# EAGLE board harp camera controller v.1.1 (EAGLE 9.5.1)
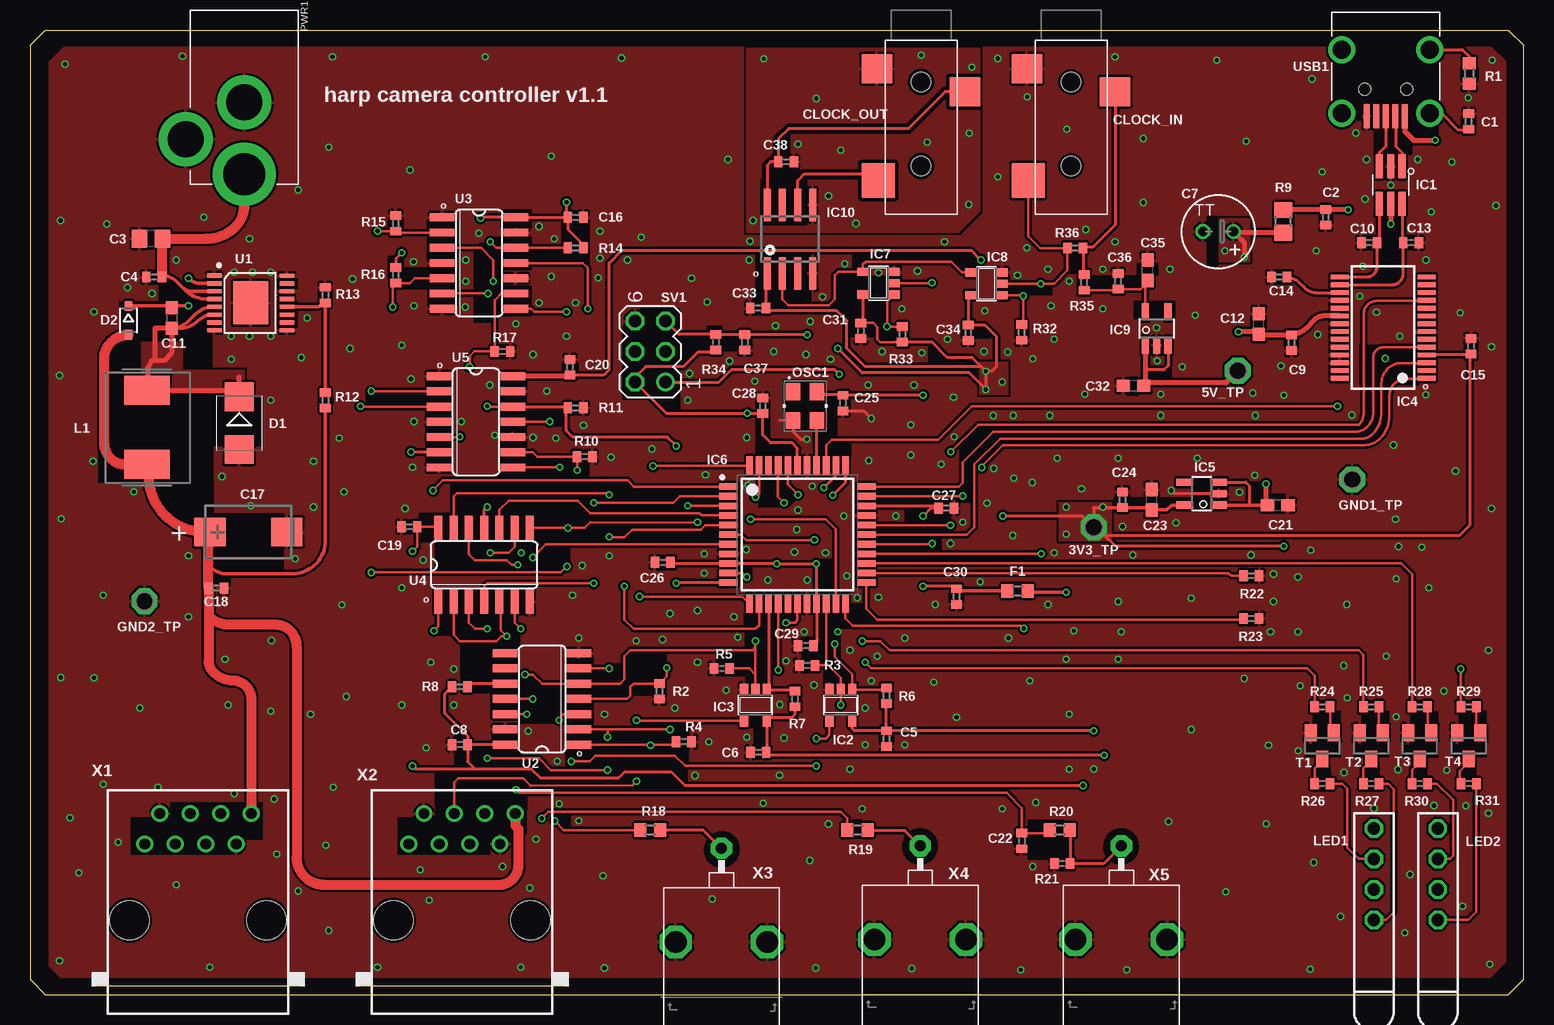
[diagram p2: board, top side]
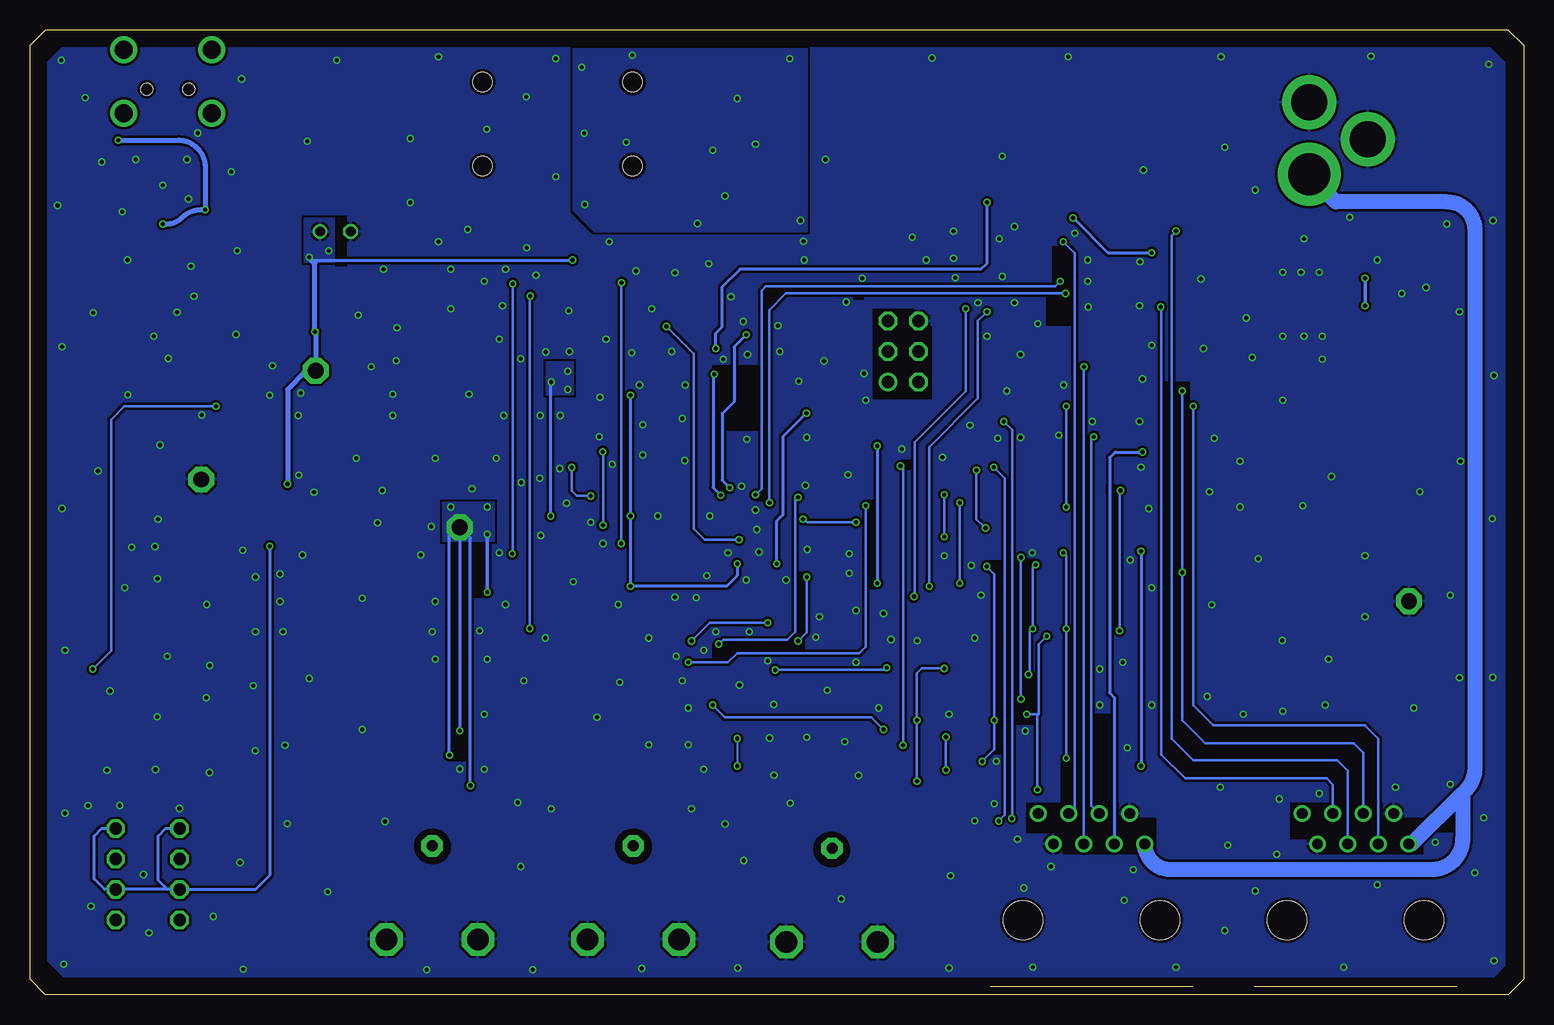
[diagram p3: board, bottom side, seen from below]

Size 124.46 x 80.38 mm. Coordinates in mm from the lower left corner, seen from the top.
Outline: 0,79.11 0,1.27 1.27,0 123.19,0 124.46,1.27 124.46,79.11 123.19,80.38 1.27,80.38 0,79.11
Copper layers (1*16): Top 0.018mm / dielectric 0.36mm / Bottom 0.018mm
Design rules "harp camera controller v.1.0 design rules": minimum track width 0.15mm, minimum drill 0.35mm, track to track 6mil, track to pad 6mil, pad to pad 6mil, via to via 6mil, smd to smd 6mil, copper to edge 0.25mm, drill to drill 0.35mm, minimum pad ring 0.175mm, minimum via ring 0.125mm, stop-mask expansion 0mil, vias tented up to drill 0.45mm, thermal gap 0.2mm
Net classes: 0 default: clearance 0.205 mm; 1 IOss: clearance 0.35 mm

## Footprints (pad centres in the part's own frame; a part is rotated, then mirrored left to right if it is on the bottom)
P1-13 = drill 1.321 pad 2.159 octagon: TP 0,0
C0402 = smd 0.7 x 0.9: 1 -0.65,0; 2 0.65,0
C0805 = smd 1.3 x 1.5: 1 -0.95,0; 2 0.95,0
TT2D6 = drill 0.813: + -1.27,0 | drill 0.813 octagon: - 1.27,0
C0603 = smd 1.1 x 1: 1 -0.85,0; 2 0.85,0
CT7343 = smd 2.6 x 2.4: + -3.2,0; - 3.2,0
35RASMT2BHNTRX = smd 2.4 x 2.55: 1 0.8,3.675; 5 -1.1,-3.675 | smd 2.9 x 2.75: 4 8.2,-3.575 | hole 1.6: 0,0; 7,0
SMB = smd 2.4 x 2.4: A 2.2,0; C -2.2,0
SOD323-R = smd 0.8 x 0.6: A 1.2,0; C -1.2,0
R0603 = smd 1 x 1.1: 1 -0.85,0; 2 0.85,0
SOT23-6L = smd 0.6 x 2: P$1 -0.95,-1.55; P$2 0,-1.55; P$3 0.95,-1.55; P$4 0.95,1.55; P$5 0,1.55; P$6 -0.95,1.55
SOT23-5 = smd 0.69 x 0.99: 1 -0.95,-1.29; 2 0,-1.29; 3 0.95,-1.29; 4 0.95,1.3; 5 -0.95,1.3
SSOP28 = smd 0.4 x 1.5: 1 -4.225,-3.625; 2 -3.575,-3.625; 3 -2.925,-3.625; 4 -2.275,-3.625; 5 -1.625,-3.625; 6 -0.975,-3.625; 7 -0.325,-3.625; 8 0.325,-3.625; 9 0.975,-3.625; 10 1.625,-3.625; 11 2.275,-3.625; 12 2.925,-3.625; 13 3.575,-3.625; 14 4.225,-3.625; 15 4.225,3.625; 16 3.575,3.625; 17 2.925,3.625; 18 2.275,3.625; 19 1.625,3.625; 20 0.975,3.625; 21 0.325,3.625; 22 -0.325,3.625; 23 -0.975,3.625; 24 -1.625,3.625; 25 -2.275,3.625; 26 -2.925,3.625; 27 -3.575,3.625; 28 -4.225,3.625
TSOT23-5 = smd 0.6 x 1.408: 1 -0.95,-1.404; 2 0,-1.404; 3 0.95,-1.404; 4 0.95,1.404; 5 -0.95,1.404
QFP80P1200X1200X120-44N = smd 1.55 x 0.55: 1 -5.75,4; 2 -5.75,3.2; 3 -5.75,2.4; 4 -5.75,1.6; 5 -5.75,0.8; 6 -5.75,0; 7 -5.75,-0.8; 8 -5.75,-1.6; 9 -5.75,-2.4; 10 -5.75,-3.2; 11 -5.75,-4; 23 5.75,-4; 24 5.75,-3.2; 25 5.75,-2.4; 26 5.75,-1.6; 27 5.75,-0.8; 28 5.75,0; 29 5.75,0.8; 30 5.75,1.6; 31 5.75,2.4; 32 5.75,3.2; 33 5.75,4 | smd 0.55 x 1.55: 12 -4,-5.75; 13 -3.2,-5.75; 14 -2.4,-5.75; 15 -1.6,-5.75; 16 -0.8,-5.75; 17 0,-5.75; 18 0.8,-5.75; 19 1.6,-5.75; 20 2.4,-5.75; 21 3.2,-5.75; 22 4,-5.75; 34 4,5.75; 35 3.2,5.75; 36 2.4,5.75; 37 1.6,5.75; 38 0.8,5.75; 39 0,5.75; 40 -0.8,5.75; 41 -1.6,5.75; 42 -2.4,5.75; 43 -3.2,5.75; 44 -4,5.75
SO-08 = smd 0.6 x 2.708: 1 -1.905,-2.854; 2 -0.635,-2.854; 3 0.635,-2.854; 4 1.905,-2.854; 5 1.905,2.854; 6 0.635,2.854; 7 -0.635,2.854; 8 -1.905,2.854
L_IHLP_PADS = smd 2.413 x 3.81: 1 -3.1,0; 2 3.1,0
569-011X-X00_LED_ARRAY = drill 1.016 octagon: A1 -6.35,0; A2 -1.27,0; C1 -8.89,0; C2 -3.81,0
OSCILLATOR_3.2X2.5 = smd 1.4 x 1.2: P$1 -1.2,-1; P$2 1.2,-1; P$3 1.2,1; P$4 -1.2,1
DC_POWER_INPUT_2.1MM = drill 3.5: P1 8.5,0 | drill 3: P2 2.5,0; P3 5.55,-4.9
R0402 = smd 0.7 x 0.9: 1 -0.65,0; 2 0.65,0
R0805 = smd 1.3 x 1.5: 1 -0.95,0; 2 0.95,0
MA03-2 = drill 1.016: 1 -2.54,-1.27 | drill 1.016 octagon: 2 -2.54,1.27; 3 0,-1.27; 4 0,1.27; 5 2.54,-1.27; 6 2.54,1.27
SOT23 = smd 1 x 1.4: 1 -0.95,-1.1; 2 0.95,-1.1; 3 0,1.1
TSSOP16EXP = smd 0.35 x 1.2: 1 -2.159,-2.897; 2 -1.504,-2.897; 3 -0.854,-2.897; 4 -0.204,-2.897; 5 0.446,-2.897; 6 1.096,-2.897; 7 1.746,-2.897; 8 2.396,-2.897; 9 2.396,3.148; 10 1.746,3.148; 11 1.096,3.148; 12 0.446,3.148; 13 -0.204,3.148; 14 -0.854,3.148; 15 -1.504,3.148; 16 -2.154,3.148 | smd 3.58 x 2.9: 17 0.121,0.126
SO14 = smd 0.66 x 2.032: 1 -3.81,-3.073; 2 -2.54,-3.073; 3 -1.27,-3.073; 4 0,-3.073; 5 1.27,-3.073; 6 2.54,-3.073; 7 3.81,-3.073; 8 3.81,3.073; 9 2.54,3.073; 10 1.27,3.073; 11 0,3.073; 12 -1.27,3.073; 13 -2.54,3.073; 14 -3.81,3.073
240-0002-1 = smd 0.5 x 2: P$1 -1.6,8.65; P$2 -0.8,8.65; P$3 0,8.65; P$4 0.8,8.65; P$5 1.6,8.65 | drill 1.5: SHIELD_1 -3.65,3.1; SHIELD_2 3.65,3.1; SHIELD_3 3.65,8.4; SHIELD_4 -3.65,8.4 | hole 1: -1.75,6.4; 1.75,6.4
RJ45-NO-SHIELD = drill 0.9 pad 1.4: 1 -4.445,6.35; 2 -3.175,8.89; 3 -1.905,6.35; 4 -0.635,8.89; 5 0.635,6.35; 6 1.905,8.89; 7 3.175,6.35; 8 4.445,8.89 | hole 3.251: -5.715,0; 5.715,0
0731000105 = drill 0.914 pad 1.778 octagon: 1 0,12.395 | drill 1.803 octagon: 2 -3.81,4.597; 3 3.81,4.597

## Placement (x,y rotation side)
3V3_TP  TPPAD1-13  [P1-13]  88.64,38.94 0 top
5V_TP  TPPAD1-13  [P1-13]  100.66,51.99 0 top
C1  4.7nF  [C0402]  119.89,72.76 90 top
C2  100nF  [C0402]  107.98,64.77 270 top
C3  4.7uF  [C0805]  10.08,62.99 180 top
C4  100nF  [C0402]  10.34,59.79 180 top
C5  100nF  [C0402]  71.37,21.34 270 top
C6  100nF  [C0402]  60.71,20.19 180 top
C7  100u 25V  [TT2D6]  99.01,63.59 180 top
C8  100nF  [C0402]  35.81,20.83 180 top
C9  100nF  [C0402]  105.13,54.33 270 top
C10  47pF  [C0402]  111.61,62.66 180 top
C11  180nF  [C0603]  11.81,56.39 270 top
C12  4.7uF  [C0603]  102.41,55.88 90 top
C13  47pF  [C0402]  115.09,62.66 0 top
C14  100nF  [C0402]  104.11,59.79 180 top
C15  100nF  [C0402]  120.09,54.03 90 top
C16  100nF  [C0402]  45.47,64.77 0 top
C17  100uF 16V  [CT7343]  18.2,38.55 0 top
C18  100nF  [C0402]  15.51,33.87 0 top
C19  100nF  [C0402]  31.62,38.99 180 top
C20  100nF  [C0402]  45,52.28 90 top
C21  4.7uF  [C0603]  103.98,40.79 0 top
C22  330pF  [C0402]  82.65,12.8 270 top
C23  4.7uF  [C0603]  93.47,41.24 90 top
C24  100nF  [C0402]  91.04,41.24 90 top
C25  100nF  [C0402]  67.74,49.29 270 top
C26  100nF  [C0402]  52.73,36.02 180 top
C27  100nF  [C0402]  76.35,40.54 0 top
C28  100nF  [C0402]  61.06,49.07 90 top
C29  100nF  [C0402]  64.64,29.08 180 top
C30  330pF  [C0402]  77.22,33.17 270 top
C31  100nF  [C0402]  69.24,55.32 270 top
C32  4.7uF  [C0603]  91.97,50.73 180 top
C33  100nF  [C0402]  60.67,57.21 180 top
C34  100nF  [C0402]  78.19,55.17 270 top
C35  4.7uF  [C0603]  93.13,60.36 90 top
C36  100nF  [C0402]  90.68,59.44 90 top
C37  330pF  [C0402]  59.57,54.35 270 top
C38  100nF  [C0402]  63,69.41 0 top
CLOCK_IN  CLCK_JACK  [35RASMT2BHNTRX]  86.75,76.05 270 top
CLOCK_OUT  CLCK_JACK  [35RASMT2BHNTRX]  74.25,76.05 270 top
D1  SSB43L-E3  [SMB]  17.43,47.63 270 top
D2  CMDSH-3  [SOD323-R]  8.21,56.18 270 top
F1  330 Ohms @ 100MHz  [R0603]  82.3,33.63 0 top
GND1_TP  TPPAD1-13  [P1-13]  110.19,42.93 0 top
GND2_TP  TPPAD1-13  [P1-13]  9.54,32.79 0 top
IC1  USBLC6-2SC6  [SOT23-6L]  113.39,67.46 180 top
IC2  74LVC1G240DBV  [SOT23-5]  67.56,24.13 180 top
IC3  74LVC1G240DBV  [SOT23-5]  60.45,24.13 180 top
IC4  FT232RL  [SSOP28]  112.75,55.58 90 top
IC5  TLV70033DDCR  [TSOT23-5]  97.64,41.75 90 top
IC6  ATXMEGA32A4U-AU  [QFP80P1200X1200X120-44N]  63.95,38.33 0 top
IC7  SN74LVC1G125DBVT  [SOT23-5]  70.71,59.28 90 top
IC8  SN74LVC1G125DBVT  [SOT23-5]  79.71,59.23 90 top
IC9  TLV70033DDCR  [TSOT23-5]  93.89,55.51 0 top
IC10  SI8610BC-B-IS  [SO-08]  63.33,62.95 0 top
L1  10uH 3A  [L_IHLP_PADS]  9.75,47.28 90 top
LED1  RED_LEDs  [569-011X-X00_LED_ARRAY]  111.99,15.11 90 top
LED2  RED_LEDs  [569-011X-X00_LED_ARRAY]  117.32,15.11 90 top
OSC1  OSCILLATOR  [OSCILLATOR_3.2X2.5]  64.58,49.05 270 top
PWR1  DC_JACK2.1MM  [DC_POWER_INPUT_2.1MM]  17.87,76.85 270 top
R1  100R  [R0603]  119.94,76.76 270 top
R2  10k  [R0402]  52.45,25.27 90 top
R3  10k  [R0402]  64.77,27.43 0 top
R4  10k  [R0402]  54.48,21.08 180 top
R5  10k  [R0402]  57.66,27.18 0 top
R6  10k  [R0402]  71.37,24.89 90 top
R7  10k  [R0402]  63.75,24.64 90 top
R8  10k  [R0402]  35.81,25.65 0 top
R9  40R@100MHz  [R0805]  104.44,64.44 90 top
R10  10k  [R0402]  46.23,44.83 0 top
R11  10k  [R0402]  45.47,48.9 0 top
R12  31.6k  [R0402]  24.61,49.52 270 top
R13  10k  [R0402]  24.61,58.3 270 top
R14  1k  [R0402]  45.47,62.23 180 top
R15  10k  [R0402]  30.48,64.26 270 top
R16  1k  [R0402]  30.48,59.94 270 top
R17  10k  [R0402]  39.37,53.59 180 top
R18  100R  [R0603]  51.69,13.72 180 top
R19  100R  [R0603]  68.96,13.72 180 top
R20  100R  [R0603]  85.81,13.72 180 top
R21  10k  [R0402]  86.02,10.92 0 top
R22  10k  [R0402]  101.78,34.9 0 top
R23  10k  [R0402]  101.78,31.34 0 top
R24  1k  [R0402]  107.7,23.98 0 top
R25  1k  [R0402]  111.76,23.98 0 top
R26  330R  [R0402]  107.7,17.58 180 top
R27  330R  [R0402]  111.76,17.58 180 top
R28  1k  [R0402]  115.82,23.98 0 top
R29  1k  [R0402]  119.89,23.98 0 top
R30  330R  [R0402]  115.82,17.58 180 top
R31  330R  [R0402]  119.89,17.58 180 top
R32  10k  [R0402]  82.64,55.18 270 top
R33  10k  [R0402]  72.7,55.02 270 top
R34  10k  [R0402]  57.15,54.37 270 top
R35  10R  [R0402]  87.84,59.35 90 top
R36  10k  [R0402]  87.1,62.21 180 top
SV1  PROG HEADER  [MA03-2]  51.69,53.59 90 top
T1  BC850  [SOT23]  107.7,20.73 180 top
T2  BC850  [SOT23]  111.76,20.73 180 top
T3  BC850  [SOT23]  115.82,20.73 180 top
T4  BC850  [SOT23]  119.89,20.73 180 top
U1  LT1765  [TSSOP16EXP]  18.26,57.76 270 top
U2  74LVC126ASO14  [SO14]  42.67,24.64 90 top
U3  74LVC126ASO14  [SO14]  37.42,60.97 270 top
U4  74LVC126ASO14  [SO14]  37.85,35.81 0 top
U5  74HCT125SO14  [SO14]  37.16,47.73 270 top
USB1  mini USB  [240-0002-1]  112.98,81.85 180 top
X1  RJ45  [RJ45-NO-SHIELD]  14,6.2 0 top
X2  RJ45  [RJ45-NO-SHIELD]  36,6.2 0 top
X3  BNC plug  [0731000105]  57.62,-0.2 0 top
X4  BNC plug  [0731000105]  74.18,0 0 top
X5  BNC plug  [0731000105]  90.95,0 0 top

## Tracks (layer width: path | path; a pad name or v marks a point on that pad's centre or on a via)
5VUSB  (via drill 0.35)
  Top 0.406: USB1.P$1 114.58,71.93 115.34,71.17 117.06,71.17 v117.09,71.2 | IC1.P$5 v113.39,64.21 | v109.86,65.41 108.01,65.41 arc-45 C2.1 104.52,65.42 arc45 R9.2
  Bottom 0.406: v117.09,71.2 112.03,71.2 arc45 110.62,70.61 110.49,70.48 arc45 109.86,68.95 v109.86,65.41 110.23,65.41 arc-45 111.76,64.77 arc45 113.11,64.21 v113.39,64.21
+3V3  (via drill 0.35)
  Top 0.203: v31.88,36.96 31.89,36.96 32.27,37.34 C19.1 33.93,38.99 U4.14 | 72.06,54.37 70.86,54.37 70.61,54.61 70.61,55.63 70.26,55.98 C31.1
  Top 0.254: 93.27,40.59 C23.1 | IC10.1 61.43,60.17 C33.1 61.32,56.99 67.22,56.99 68.07,56.13 68.07,53.85 69.58,52.34 79.27,52.34 v79.65,51.96 | C15.1 120.02,53.3 119.97,53.3 | 119.97,53.3 IC4.4 | IC8.5 78.19,58.06 C34.1 79.57,55.82 80.52,54.86 80.52,52.31 80.16,51.96 v79.65,51.96 | 119.97,53.3 120.02,53.26 120.02,39.15 119.12,38.25 89.58,38.25 | C31.1 69.41,56.14 IC7.5 | U2.14 C8.1 | 44.7,64.78 U3.14 37.6,64.78 v37.54,64.72 | 44.7,64.78 C16.1 44.82,63.78 46.12,62.48 R14.1 | C5.1 R6.1 | C5.1 68.72,21.99 68.51,22.2 IC2.5 | R7.1 63.75,23.37 63.47,23.08 61.66,23.08 IC3.5 61.4,20.24 C6.1 61.61,19.94 v89.51,19.94 | v104.49,37.36 90.47,37.36 89.58,38.25 | 88.64,40.59 3V3_TP.TP | 83.25,33.53 F1.2 | 3V3_TP.TP 87.7,39.88 v81.06,39.88 | v79.65,51.96 v79.65,50.43 78.27,51.81 69.34,51.81 v67.31,53.85 | v79.65,51.96 78.52,53.09 76.45,53.09 75.17,54.37 R33.2 72.06,54.37 | v44.7,66.04 44.7,64.78 | R16.1 30.49,60.6 30.49,61.33 v30.99,61.82 | R8.1 34.53,25.02 34.53,23.5 36.46,21.56 C8.1 | v87.76,17.42 54.59,17.42 53.47,18.54 49.53,18.54 49.02,18.03 42.55,18.03 41.78,18.8 37.08,18.8 | C8.1 36.46,19.42 37.08,18.8 | v88.65,22 88.64,21.99 C5.1 | 3V3_TP.TP 89.32,38.25 89.58,38.25 | 37.08,18.8 32.13,18.8 v31.88,19.05
  Top 0.305: C23.1 94.74,40.39 95.15,40.8 IC5.5 | 93.27,40.59 C24.1 88.64,40.59 | v86.36,33.53 83.25,33.53
  Bottom 0.203: v31.88,19.05 31.85,19.08 | 31.85,36.93 v31.88,36.96
  Bottom 0.254: LED1.A1 LED2.A1 118.24,8.76 119.13,9.65 119.13,13.21 118.49,13.84 LED2.A2 | LED1.A1 113.01,8.76 113.79,9.55 113.79,13.21 113.16,13.84 LED1.A2 | v104.49,37.36 104.49,9.94 105.66,8.76 LED1.A1 | v81.03,51.05 81.06,51.02 v81.06,39.88 | v44.7,66.04 44.7,60.96 45.21,60.45 65.28,60.45 66.8,58.93 66.8,55.63 67.31,55.12 v67.31,53.85 | v37.54,64.72 34.65,61.82 v30.99,61.82 | v88.65,22 88.64,22.01 3V3_TP.TP 87.76,38.06 v87.76,17.42 | v89.51,19.94 89.53,19.96 89.53,38.56 89.15,38.94 | 31.85,36.93 31.85,19.08
  Bottom 0.305: 3V3_TP.TP 89.15,38.94 | v86.36,38.35 v86.36,33.53
  other vias: 86.36,40.64 89.41,40.64
  pour Bottom (isolate 0.305, no thermals): 85.75,41.05 90.12,41.05 90.12,37.8 85.75,37.8
  pour Bottom (no thermals): 79.15,52.73 81.48,52.73 81.48,49.99 79.15,49.99
  pour Top (isolate 0.305, no thermals): 85.75,41.05 90.12,41.05 90.12,37.8 85.75,37.8
  pour Top (no thermals): 79.15,52.73 81.48,52.73 81.48,49.99 79.15,49.99
+5V  (via drill 0.35)
  Top 0.254: C20.1 47.82,51.63 48.27,52.08 48.27,60.96 49.28,61.98 78.49,61.98 v79.25,61.21 | 103,40.92 C21.1 | IC5.3 101.32,42.7 101.6,42.42 101.6,40.8 | IC9.3 94.84,52.42 94.49,52.07 92.94,52.07
  Top 0.305: IC5.1 101.6,40.8 C21.1
  Top 0.406: IC9.1 92.94,52.07 92.94,50.87 C32.1 93.07,50.99 99.65,50.99 5V_TP.TP | IC4.20 107.76,56.55 arc45 107.06,56.26 106.3,55.5 arc-45 105.19,55.04 C9.1 102.3,54.98 102.35,55.03 C12.1 102.25,55.03 102.03,55.24 v100.71,55.24 | R9.1 100.33,63.49 C7.+ 101.19,62.68 v101.19,61.44 | C20.1 44.5,51.54 U5.14 | C21.1 | v103,42.55 103,40.92
  Bottom 0.254: v101.19,61.44 100.97,61.21 v79.25,61.21
  Bottom 0.406: v103,42.55 103,50.42 101.42,51.99 5V_TP.TP 100.66,55.19 v100.71,55.24 100.71,60.96 arc45 v101.19,61.44
  other vias: 99.57,61.98
  pour Top: 99.06,64.64 101.6,64.64 101.6,61.09 99.06,61.09
  pour Bottom: 99.06,64.64 101.6,64.64 101.6,61.09 99.06,61.09
+5V_VIN
  Top 0.305: R12.2 24.61,37.85 arc-90 21.82,35.05 16.48,35.05 arc-45 14.98,35.68 arc-45 14.86,35.96 | 14.86,38.41 C17.+
  Top 0.406: 7.95,44.18 L1.1 9.91,44.18 9.91,43.22 | C17.+ 14.57,38.55
  Top 0.508: C18.1 14.86,31.59 14.95,31.5 | 14.86,37.44 14.86,38.41 | 15.35,26.81 15.24,26.92
  Top 0.813: X2.8 40.45,14.07 40.7,13.82 40.7,10.77 arc-90 39.07,9.14 24.51,9.14 arc-90 22.23,11.43 22.23,29.05 arc90 20.45,30.83 16.57,30.83 arc-45 14.95,31.5 | X1.8 18.45,24.64 arc90 16.92,26.16 arc-45 15.35,26.81 | 14.86,37.44 14.86,35.96 C18.1 14.88,33.85 14.88,27.78 arc45 15.24,26.92 | 7.95,44.18 arc-90 6.17,45.96 6.17,52.95 arc-45 6.77,54.39 arc-45 D2.A | 14.57,38.55 arc-45 11.27,39.91 arc-45 9.91,43.22
+12V
  Top 0.305: U1.3 13.46,58.62 arc-45 12.7,58.93 | 12.7,58.93 12.21,59.41 arc45 11.03,59.9 | U1.4 14.71,57.97 arc-45 12.92,58.71 12.7,58.93
  Top 0.406: C4.1 arc45 11.03,59.9
  Top 0.508: 17.87,65.76 PWR1.P1
  Top 0.813: 17.87,65.76 arc-45 17.14,64.01 arc-45 14.7,62.99 C3.1 11.03,59.9
  Bottom 0.508: X1.1 9.29,12.55
  Bottom 0.813: PWR1.P1 17.87,68.3 | 4.81,17.04 5.08,16.76
  Bottom 1.27: 9.29,12.55 5.08,16.76 5.08,12.95 arc90 7.62,10.41 29.42,10.41 arc90 X2.1 | 17.87,68.3 15.63,66.06 6.37,66.06 arc90 4.06,63.75 4.06,18.83 arc45 4.81,17.04
AUX_IO1
  Top 0.203: IC6.24 99.86,35.13 100.09,34.9 R22.1
AUX_IO2
  Top 0.203: IC6.23 69.7,32.15 70.61,31.24 101.03,31.24 R23.1
CLOCK_IN  (via drill 0.35)
  Top 0.203: CLOCK_IN.4 83.18,63.2 84.17,62.21 R36.2 86.45,60.36 85.34,59.25 v84.24,59.25 84.22,59.23 IC8.2 | IC6.26 v84.28,36.73 | v84.28,36.73
  Bottom 0.203: v84.24,59.25 84.24,36.77 v84.28,36.73
CLOCK_OUT  (via drill 0.35)
  Top 0.203: v75.16,59.33 75.21,59.28 IC7.2 | IC6.27 75.12,37.53 v75.18,37.59
  Bottom 0.203: v75.18,37.59 75.18,59.31 v75.16,59.33
EN_CLOCK_IN  (via drill 0.35)
  Top 0.203: IC8.1 82.7,58.28 v82.76,58.21 82.76,55.95 R32.1 | v82.8,30.5 82.57,30.73 68.58,30.73 67.95,31.36 IC6.22
  Bottom 0.203: v82.76,58.21 82.81,58.16 82.81,30.5 v82.8,30.5
EN_CLOCK_OUT  (via drill 0.35)
  Top 0.203: IC7.1 71.42,57.75 v71.42,55.68 71.43,55.67 R33.1 | v65.38,37.9 65.35,37.87 59.68,37.87 59.22,38.33 IC6.6
  Bottom 0.203: v65.38,37.9 68.22,37.9 69.14,38.81 69.14,53.39 v71.42,55.68
FTDI_CTS  (via drill 0.35)
  Top 0.203: IC4.11 116.34,57.81 112.27,57.81 arc90 111.12,56.67 111.12,48.4 arc-45 110.75,47.5 79.01,47.5 v76.74,45.23 | IC6.29 76.7,39.13 v76.71,39.12
  Bottom 0.203: v76.74,45.23 76.71,45.2 v76.71,39.12
FTDI_RTS
  Top 0.203: IC4.3 116.35,52.63 114.29,52.63 arc90 112.62,50.96 112.62,48.51 arc-45 111.87,46.7 arc-45 110.98,46.33 80.84,46.33 78.69,44.18 78.69,42.48 78.68,42.48 78.68,38.96 78.05,38.33 IC6.28
FTDI_RXD
  Top 0.203: IC4.5 112.78,53.95 arc90 111.94,53.1 111.94,48.52 arc-45 111.44,47.33 arc-45 110.38,46.89 80.26,46.89 77.72,44.35 77.72,42.67 77.38,42.33 IC6.33
FTDI_TXD  (via drill 0.35)
  Top 0.203: IC4.1 116.33,51.31 114.66,51.31 arc90 113.29,49.93 113.29,48.22 arc-45 112.52,46.36 arc-45 111.1,45.77 81.08,45.77 79.32,44.02 v79.32,43.92 | IC6.32 77.7,41.53 v77.72,41.55
  Bottom 0.203: v77.72,41.55 78.89,41.55 79.32,41.98 v79.32,43.92
GND  (via drill 0.35)
  Top 0.203: OSC1.P$2 62.48,47.85
  Top 0.254: OSC1.P$2 63.59,46.91 64.21,46.28 v64.72,46.28 | C25.2 69.47,48.64 v70.1,48.01 | IC5.2 95.36,41.75 v95.1,42.01
  other vias: 97.1,56.61 83.1,74.81 80.66,78.01 90.41,78.17 105.69,20.32 100.79,41.85 114.14,54.87 116.76,65.24 122.17,65.76 116.31,49.99 118.47,69.38 119.86,74.74 110.49,71.8 106.83,76.3 112.94,53 104.47,49.94 87.97,63.76 115.65,69.59 98.91,77.85 3.33,14.73 2.56,26.43 2.61,39.66 2.46,51.59 31.67,68.71 2.91,77.54 12.71,78.2 25.21,78.15 49.3,78.05 2.54,64.52 47.87,2.22 73.49,2.17 91.39,2.06 106.69,2.12 94.87,14.43 99.64,8.57 114.55,5.15 121.64,2.53 121.54,15.11 105.84,25.73 109.77,24.73 113.63,45.8 121.54,28.7 121.79,53.98 121.79,40.51 121.85,77.87 92.77,71.35 92.77,66.01 101.18,26.34 119.18,56.82 37.94,78.16 65.47,2.22 2.46,2.82 82.57,2.07 67.89,60.91 112.2,56.86 101.9,50.14 111.38,69.6 56.84,7.97 107.3,55 110.16,48.3 109.2,6.5 117.8,25.3 110.8,58.2 111.05,60.7 104.25,52.4 86.41,72.12 80.65,68.16 113.4,67.45 103.02,14.23 113.85,23.15 114,18.75 118.05,18.7 109.5,18.5 103.21,20.79 112,15.5 116.99,15.75 115,10 106.97,11.01 83.57,10.67 64.97,11.18 72.14,39.88 77.72,39.37 58.29,52.81 5.25,44.44 50.52,29.49 45.21,33.27 9.14,23.88 14.99,2.29 40.89,2.29 31.95,61.06 36.32,61.21 42.42,64.01 43.43,59.84 36.27,57.3 41.91,53.34 36.32,59.44 85.34,36.83 56.18,36.73 56.18,35.1 58.67,31.5 55.63,32 22.61,53.09 20.07,49.53 5.33,56.9 10.16,58.42 17.02,60.2 20.07,60.2 16.76,54.86 20.07,54.86 18.29,54.86 18.54,60.2 8.13,58.93 42.42,57.66 45.47,57.66 47.5,61.37 47.5,63.6 43.69,62.99 37.39,63.45 28.96,2.29 6.1,33.27 6.1,17.53 43.43,69.85 50.93,63.12 54.81,49.53 26.37,24.84 26.16,41.91 24.89,5.33 24.64,12.45 30.99,33.91 30.99,24.13 25.27,17.27 38.73,46.61 64.77,34.54 63.7,36.88 65.18,42.37 70.71,33.12 75.44,32.51 90.68,44.7 85.6,44.7 97.28,44.7 84.84,32.51 96.77,33.02 90.68,32.77 90.93,30.23 86.97,30.33 68.94,33.07 116.56,33.91 113.84,34.65 114.05,37.34 106.73,37.03 101.75,36.63 91.9,36.63 113.79,39.62 118.8,43.64 47.75,9.91 32.51,10.41 16.51,24.13 13.21,31.5 25.78,46.35 26.67,53.85 26.87,59.64 22.35,67.06 24.89,70.61 103.63,32.77 75.31,26.04 77.22,23.11 83.31,26.16 86.61,23.37 69.9,44.5 73.41,44.96 68.07,34.9 59.69,37.08 23.37,23.37 61.47,34.54 66.29,36.83 105.66,34.8 70.1,26.16 72.9,29.72 81.53,29.72 90.68,27.94 88.65,18.8 96.77,22.1 86.61,18.77 68.33,18.77 62.46,18.29 55.42,18.26 75.95,44.2 77.01,46.48 80.26,48.26 81.94,48.26 84.99,48.26 102.11,48.26 94.23,48.26 102.06,43.28 95.5,39.32 91.03,39.01 115.98,37.29 109.47,27.43 119.63,15.75 119.38,7.37 105.66,30.23 103.63,35.05 103.38,30.23 109.73,32.51 113.03,28.19 76.71,37.59 80.31,43.84 79.76,40.94 81.89,38.25 79.2,34.39 62.99,27.81 56.57,21.08 55.63,27.69 58.01,25.37 53.72,23.88 47.88,23.37 42.16,12.95 48.26,36.58 62.48,24.18 62.84,21.39 69.6,20.83 58.98,29.77 52.7,29.59 72.9,20.83 69.6,23.88 23.62,44.45 18.39,40.74 13.21,36.58 20.35,16.31 25.98,32.49 20.12,29.51 60.4,51.1 53.34,31.75 107.19,61.98 111.25,66.29 107.7,68.58 101.35,71.12 83.06,62.23 84.84,60.45 73.96,60.3 89.41,60.45 95,60.45 90.42,62.74 87.88,50.04 85.34,54.61 89.41,57.15 79.55,57 76.45,54.61 79.5,53.59 70.99,53.59 72.64,57.15 58.17,69.6 43.05,50.29 32,57.4 69.85,50.8 73.66,50.8 76.96,49.78 73.41,47.5 116.33,61.21 96.01,52.32 93.88,55.58 93.93,52.83 59.74,46.43 67.82,39.88 64.01,40.39 59.84,42.42 35.94,47.75 33.02,20.57 31.88,43.94 31.24,40.51 32,47.75 41.53,21.97 35.31,24.13 33.4,27.69 51.82,45.47 48.41,44.78 43.81,46.35 38.3,50.8 46.02,35.76 40.94,36.83 32.77,36.22 46.13,47.45 56.29,43.33 54.97,51.77 65.33,25.81 59.74,21.44 59.99,62.79 49.78,61.21 82.3,59.94 81.48,53.54 94.23,50.04 31.75,51.31 30.99,54.1 40.49,55.91 44.7,54.86 16.76,52.93 41.91,46.43 45.72,29.72 5.33,26.42 16.26,27.94 20.07,23.62 39.37,10.67 41.66,8.89 33.27,7.87 22.35,8.64 20.57,11.68 7.37,12.7 17.02,16.76 83.57,52.98 86.61,59.44 85.09,57.4 74.32,53.49 70.71,60.15 35.31,27.13 56.44,57.71 55.12,59.69 66.7,52.93 61.98,53.59 62.13,55.73 66.04,58.17 59.94,61.21 47.35,59.74 45.72,14.48 83.82,16 81.03,15.49 69.34,15.49 66.55,14.22 10.67,17.27 76.2,62.74 63.91,38.76 64.67,53.34 65.02,56.08 16,43.18 22.1,36.32 23.62,40.64 23.11,56.39 44.09,15.9 61.11,15.95 12.19,61.21 18.29,62.99 6.4,64.21 14.48,64.77 8.64,41.91 43.94,19.46 83.52,42.67 81.99,43.03 87.63,42.16 86.36,27.94 70.61,28.19 67.31,30.23 68.33,28.7 64.52,30.23 12.19,9.14 4.06,10.16
  pour Top (rank 2): 121.67,1.45 123,2.79 123,77.72 121.77,78.95 2.8,78.95 1.55,77.7 1.55,2.4 2.5,1.45
  pour Bottom (rank 2): 121.67,1.45 123,2.79 123,77.72 121.77,78.95 2.8,78.95 1.55,77.7 1.55,2.4 2.5,1.45
GND_ISO  (via drill 0.35)
  other vias: 74.27,78.28 78.49,77.27 78.28,71.78 78.23,65.84 61.15,77.98 74.76,71.02 60.25,64.52 67.56,70.36 65.53,74.68 68.83,64.26 64.01,70.87 66.55,66.55
  pour Top (isolate 0.305): 59.73,78.83 59.73,63.59 77.41,63.59 79.13,65.31 79.13,74.15 79.14,78.83
  pour Bottom (isolate 0.305): 59.73,78.83 59.73,63.59 77.41,63.59 79.13,65.31 79.13,74.15 79.15,78.83
IN_0_BNC
  Top 0.254: R20.1 86.66,13.57 86.67,13.56 R21.2 89.47,10.92 X5.1
IN_0_BNC_5V  (via drill 0.35)
  Top 0.203: R20.2 84.7,13.45 C22.1 82.65,15.54 81.38,16.81 40.76,16.81 v40.5,17.07 | U2.12 v41.4,23.37 | U4.2 35.31,29.97 35.81,29.46 38.85,29.46 39.25,29.87 v39.74,29.87 39.23,30.38 39.23,32.62 U4.5
  Bottom 0.203: v41.4,23.37 40.5,23.37 | 40.5,23.37 40.4,23.37 40.4,29.2 39.74,29.86 v39.74,29.87 | 40.5,23.37 v40.5,17.07
IN_CAM1_5V_TOL  (via drill 0.35)
  Top 0.203: U3.2 30.59,63.51 R15.2 28.97,63.61 v28.96,63.63
  Bottom 0.203: X1.5 14.63,18.65 15.52,19.54 27.54,19.54 29.33,21.33 29.33,63.25 v28.96,63.63
IN_CAM1_5V_TOL_PULLUP  (via drill 0.35)
  Top 0.203: U3.5 32.06,59.7 31.66,59.29 R16.2 30.23,59.04 v30.23,57.3
  Bottom 0.203: X1.6 15.9,17.5 16.41,18.01 28.19,18.01 30.17,20 30.17,57.25 v30.23,57.3
IN_CAM2_5V_TOL  (via drill 0.35)
  Top 0.203: v36.63,52.32 36.63,53.21 37.01,53.59 R17.2 38.72,57.88 39.27,58.42 U3.9
  Bottom 0.203: X2.5 v36.63,52.32
IN_CAM2_5V_TOL_PULLUP  (via drill 0.35)
  Top 0.203: R14.2 U3.12 38.86,62.23 v38.35,62.74
  Bottom 0.203: X2.6 37.4,15.6 37.4,61.78 v38.35,62.74
LED_CAM1  (via drill 0.35)
  Top 0.203: IC6.3 58.19,40.74 v54.81,40.74 | v69.6,27.69 70.1,27.18 106.43,27.18 107.05,26.56 R24.1
  Bottom 0.203: v69.6,27.69 66.29,27.69 65.53,28.45 55.37,28.45 54.81,29.01 v54.81,40.74
LED_CAM2  (via drill 0.35)
  Top 0.203: v69.34,29.46 70.87,29.46 71.63,28.7 110.74,28.7 111.11,28.34 R25.1 | IC6.17 63.95,31.19 63.75,30.99 v62.99,30.99
  Bottom 0.203: v69.34,29.46 67.82,30.99 v62.99,30.99
LED_PWR
  Top 0.203: IC6.25 114.26,35.93 115.17,35.01 R28.1
LED_STATE  (via drill 0.35)
  Top 0.203: v108.97,49.02 78.49,49.02 75.69,46.23 66.8,46.23 66.35,45.78 IC6.36 | R29.1 119.24,27.12 v119.23,27.13
  Bottom 0.203: v108.97,49.02 116.59,49.02 117.7,47.9 117.7,28.65 v119.23,27.13
N$1
  Top 0.203: R24.2 108.35,22.13 T1.1
N$2
  Top 0.254: CLOCK_OUT.4 70.18,68.35 64.47,68.35 63.97,67.84 IC10.6
N$3
  Top 0.254: U2.10 36.72,25.91 R8.2
N$4
  cutout Top: 41.81,37.69 32.44,37.69 32.44,40.16 41.81,40.16
N$5
  Top 0.254: CLOCK_OUT.1 76.27,75.25 73.19,72.17 63.22,72.17 62.35,71.31 C38.1 61.73,69.41 61.43,69.11 IC10.8
N$6
  cutout Top: 64.31,26.82 65.33,26.82 65.33,28.04 64.31,28.04
N$7
  Top 0.203: T1.3 107.7,19.5 107.05,18.85 R26.2
N$8
  cutout Top: 78.23,44.07 77.47,44.07 77.47,45.77 78.23,45.77
N$9
  cutout Top: 60.45,49.53 60.45,48.51 61.67,48.51 61.67,49.53
N$10
  cutout Top: 67.16,49.83 67.16,48.82 68.38,48.82 68.38,49.83
N$11
  cutout Top: 68.12,55.58 68.12,54.81 70.87,54.81 70.87,55.58
N$12
  cutout Top: 72.03,55.52 72.03,54.51 73.25,54.51 73.25,55.52
N$13
  cutout Top: 116.23,71.22 116.23,72.64 117.35,72.64 117.35,71.22
N$14
  cutout Top: 77.57,55.73 77.57,54.71 80.06,54.71 80.06,55.73
N$15
  cutout Top: 82.04,55.73 82.04,54.71 83.26,54.71 83.26,55.73
N$16
  cutout Top: 86.61,61.62 87.63,61.62 87.63,62.84 86.61,62.84
N$17
  Top 0.305: U1.6 15.25,56.66 arc45 13.97,56.13 arc-45 12.54,55.54 C11.2 arc45 13.18,56.11 13.72,56.64 arc-45 15.34,57.31 U1.5
  Top 0.406: 9.79,50.33 16.92,50.33 D1.C 17.43,51.46 | 9.79,50.33 L1.2 | 9.79,50.33 9.79,52.21 10.16,52.83 11.18,52.83 11.81,53.47 C11.2 10.41,55.54 10.41,53.09
  Top 0.508: C11.2 11.81,55.44 | D1.C 16.87,50.38
  pour Top: 9.3,50.11 9.3,54.41 12.7,54.41 12.7,52.07 17.86,52.07 17.86,50.11
N$18
  cutout Top: 40.64,16.89 41.4,16.89 41.4,15.34 40.64,15.34
N$19  (via drill 0.35)
  Top 0.305: D2.C 11.47,57.38 arc-45 C11.1 11.81,57.41 arc45 11.83,57.4 v13.21,57.4 | v13.21,59.69 arc45 14.23,59.27 U1.2
  Bottom 0.305: v13.21,59.69 v13.21,57.4
N$20
  cutout Top: 87.22,59.79 87.22,58.78 88.44,58.78 88.44,59.79
N$21
  cutout Top: 88.04,59.89 88.04,58.88 93.07,58.88 93.07,59.89
N$22
  cutout Top: 101.7,56.44 101.7,55.17 103.07,55.17 103.07,56.44
N$23
  cutout Top: 102.26,34.26 101.5,34.26 101.5,35.51 102.26,35.51
N$24
  cutout Top: 103.63,59.18 104.65,59.18 104.65,60.4 103.63,60.4
N$25
  cutout Top: 107.39,65.28 107.39,64.26 108.61,64.26 108.61,65.28
N$26
  cutout Top: 102.26,30.71 101.5,30.71 101.5,31.95 102.26,31.95
N$27
  cutout Top: 75.95,36.91 75.18,36.91 75.18,38.15 75.95,38.15
N$28
  cutout Top: 77.44,41 77.44,41.76 78.69,41.76 78.69,41
N$29
  cutout Top: 73.71,39.29 72.95,39.29 72.95,40.54 73.71,40.54
N$30
  cutout Top: 103.53,65.28 103.53,64.26 105.36,64.26 105.36,65.28
N$31
  cutout Top: 114.35,62.08 115.37,62.08 115.37,63.3 114.35,63.3
N$32
  cutout Top: 111.15,62.08 112.17,62.08 112.17,63.3 111.15,63.3
N$33
  cutout Top: 120.7,53.49 120.7,54.51 119.48,54.51 119.48,53.49
N$34
  Top 0.203: R25.2 112.41,22.13 T2.1
N$35
  cutout Top: 62.77,51.28 66.29,51.31 66.29,50.29 67.23,50.29 67.23,47.02 62.77,47.02
N$36
  cutout Top: 103.28,40.13 104.65,40.13 104.65,41.71 103.28,41.71
N$37
  cutout Top: 60.91,67.92 60.91,64.16 64.77,64.16 64.77,67.92
N$38
  Top 0.254: C14.1 arc-45 105.91,59.19 106.17,58.93 arc45 107.2,58.5 IC4.17
N$39
  cutout Top: 60.45,61.62 60.45,58.57 64.72,58.57 64.72,61.62
N$40
  Top 0.254: USB1.P$2 113.79,72.69 113.79,70.71 114.34,70.17 IC1.P$1
N$41
  Top 0.254: R35.2 87.75,60.09 R36.1 87.81,62.27 88.55,62.27 90.43,64.15 CLOCK_IN.1
N$42
  Top 0.203: C35.1 92.94,59.33 92.94,59.18 | IC9.5 92.94,59.18 | C36.1 90.93,58.79 | 90.93,58.79 92.55,58.79 92.94,59.18 | R35.1 90.84,58.7 90.93,58.79
N$43
  Top 0.203: IC10.2 62.7,57.96 63.2,57.45 66.55,57.45 67.06,57.96 67.06,59.94 67.35,60.23 IC7.4 69.41,60.84 69.63,61.06 76.77,61.06 77.65,60.18 IC8.4
N$44
  cutout Top: 32.92,47.32 32.92,44.27 35.31,44.27 35.31,47.32
N$45
  cutout Top: 32.92,51.08 32.92,48.13 35.31,48.13 35.31,51.08
N$46
  cutout Top: 39.01,49.86 39.01,46.99 41.38,46.99 41.38,49.86
N$47
  Top 0.203: T2.3 111.62,19.63 111.62,19.36 111.11,18.85 R27.2
N$48
  cutout Top: 62.14,44.88 62.14,43.36 61.68,43.36 61.68,44.88
N$49
  cutout Top: 41.35,31.6 33.55,31.6 33.55,33.96 41.35,33.96
N$50
  Top 0.254: USB1.P$3 112.98,70.71 112.44,70.17 IC1.P$3
N$51
  cutout Top: 85.62,11.4 86.39,11.4 86.39,10.26 85.62,10.26
N$52
  cutout Top: 38.35,28.83 38.35,22.99 40.74,22.99 40.74,28.83
N$53
  Top 0.203: R28.2 116.47,22.13 T3.1
N$54
  Top 0.203: T3.3 115.82,19.37 115.17,18.72 R30.2
N$55
  cutout Top: 81.94,12.47 81.94,13.23 83.13,13.23 83.13,12.47
N$56
  Top 0.203: R29.2 120.54,22.13 T4.1
N$57
  cutout Top: 44.6,27.94 44.6,18.87 46.96,18.87 46.96,27.94
N$58
  cutout Top: 30.63,14.22 30.63,11.68 38.35,11.68 38.35,13.46 41.4,13.46 41.4,16 33.78,16 33.78,14.22
N$59
  Top 0.254: C1.1 119.83,72.05 119.03,72.05 117.63,73.45 USB1.SHIELD_4
N$60
  Top 0.203: T4.3 119.89,19.37 119.13,18.61 119.13,17.69 R31.2
N$61
  Top 0.254: USB1.SHIELD_1 119.37,78.75 119.94,78.18 R1.1
N$62
  Top 0.203: R31.1 120.54,6.9 119.86,6.22 LED2.C1
N$63
  Top 0.203: LED2.C2 118.34,11.3 118.59,11.56 118.59,16.22 117.24,17.58 R30.1
N$64
  cutout Top: 30.63,14.73 30.63,11.68 38.35,11.68 38.35,13.46 41.4,13.46 41.4,16 33.78,16 33.78,14.73
N$65
  Top 0.203: R26.1 109.36,17.58 109.78,17.16 109.78,12.24 110.72,11.3 LED1.C2
N$66
  Top 0.203: R27.1 113.17,17.58 113.64,17.11 113.64,6.86 113.01,6.22 LED1.C1
N$67
  cutout Bottom: 8.38,14.73 8.38,11.68 16.87,11.68 16.87,12.95 19.41,12.95 19.41,16 11.79,16 11.79,14.73
N$68
  cutout Top: 8.38,14.73 8.38,11.68 16.87,11.68 16.87,12.95 19.41,12.95 19.41,16 11.68,16 11.68,14.73
N$69
  cutout Top: 68.55,14.61 69.32,14.61 69.32,13 68.55,13
N$70
  cutout Top: 51.1,14.5 51.87,14.5 51.87,12.95 51.1,12.95
N$71
  cutout Top: 54.08,21.62 54.84,21.62 54.84,19.33 54.08,19.33
N$72
  cutout Top: 63.27,24.18 63.27,24.94 64.26,24.94 64.26,24.18
N$73
  cutout Top: 60.35,22.38 61.11,22.38 61.11,19.58 60.35,19.58
N$74
  cutout Top: 70.79,20.93 70.79,21.69 71.98,21.69 71.98,20.93
N$75
  cutout Top: 70.79,24.49 70.79,25.25 71.98,25.25 71.98,24.49
N$76
  cutout Top: 76.71,39.24 75.95,39.24 75.95,40.94 76.71,40.94
N$77
  cutout Top: 61.01,56.62 60.25,56.62 60.25,58.67 61.01,58.67
N$78
  cutout Top: 57.73,53.59 57.73,54.36 58.93,54.36 58.93,53.59
N$79
  cutout Top: 56.44,53.59 56.44,55.75 57.63,55.75 57.63,53.59 56.49,53.59
N$80
  cutout Top: 45.82,64.19 45.06,64.19 45.06,65.38 45.82,65.38
N$81
  cutout Top: 46.58,60.88 45.11,60.88 45.11,64.26 46.58,64.26
N$82
  cutout Top: 24,57.91 24,58.67 25.2,58.67 25.2,57.91
N$83
  cutout Top: 24,49.17 24,49.94 25.25,49.94 25.25,49.17
N$84
  cutout Top: 11.15,55.98 11.15,56.74 12.14,56.74 12.14,55.98
N$85
  cutout Top: 10.77,59.16 10.01,59.16 10.01,60.4 10.77,60.4
N$86
  cutout Top: 10.52,62.05 9.75,62.05 9.75,63.91 10.52,63.91
N$87
  cutout Top: 32.03,38.35 31.27,38.35 31.27,39.6 32.03,39.6
N$88
  cutout Top: 21.11,35.31 15.27,35.31 15.27,40.11 21.11,40.11
N$89
  cutout Top: 29.84,59.54 29.84,61.57 31.09,61.57 31.09,59.54
N$90
  cutout Top: 29.84,63.86 29.84,64.62 31.09,64.62 31.09,63.86
N$91
  cutout Top: 68.35,31.85 68.35,32.61 69.6,32.61 69.6,31.85
N$92
  cutout Top: 61.82,24.79 59.66,24.79 59.66,26.54 61.82,26.54
N$93
  cutout Top: 107.14,16.92 107.14,19.03 108.36,19.03 108.36,16.92
N$94
  cutout Top: 111.2,16.92 111.2,19.03 112.42,19.03 112.42,16.92
N$95
  cutout Top: 115.21,16.92 115.21,19.08 116.38,19.08 116.38,16.92
N$96
  cutout Top: 119.28,16.92 119.28,18.98 120.5,18.98 120.5,16.92
N$97
  cutout Top: 35.66,61.24 33.12,61.24 33.12,64.52 35.66,64.52
N$98
  cutout Top: 119.33,23.42 119.33,24.54 120.55,24.54 120.55,23.42
N$99
  cutout Top: 115.27,23.42 115.27,24.54 116.48,24.54 116.48,23.42
N$100
  cutout Top: 111.15,23.42 111.15,24.54 112.37,24.54 112.37,23.42
N$101
  cutout Top: 107.14,23.42 107.14,24.54 108.36,24.54 108.36,23.42
N$102
  cutout Top: 52.98,25.68 52.98,24.92 50.22,24.92 50.22,25.68
N$103
  cutout Top: 68.99,24.87 67.08,24.87 67.08,26.11 68.99,26.11
N$104
  cutout Top: 33.15,57.4 33.15,60.6 35.66,60.6 35.66,57.4
N$105
  cutout Top: 38.99,56.54 38.99,59.08 41.76,59.08 41.76,56.54
N$106
  cutout Top: 38.48,60.35 38.48,63.14 41.76,63.14 41.76,60.35
N$107
  cutout Top: 39.24,63.91 39.24,65.43 41.76,65.43 41.76,63.91
N$108
  cutout Top: 39.73,52.96 38.96,52.96 38.96,54.2 39.73,54.2
N$109
  cutout Top: 97.28,40.34 90.32,40.34 90.32,41.45 97.28,41.45
N$110
  cutout Top: 37.47,61.87 37.47,62.64 38.71,62.64 38.71,61.87
N$111
  cutout Top: 37.01,58.57 37.01,62.03 39.47,62.03 39.47,58.57
N$112
  cutout Top: 97.03,40.49 97.03,43.03 98.25,43.03 98.25,40.49
N$113
  cutout Top: 45.8,48.26 45.03,48.26 45.03,49.5 45.8,49.5
N$114
  cutout Top: 82.65,32.94 81.89,32.94 81.89,34.39 82.65,34.39
N$115
  cutout Top: 76.58,32.66 76.58,33.43 77.83,33.43 77.83,32.66
N$116
  cutout Top: 15.27,39.62 14.5,39.62 14.5,42.9 15.27,42.9
N$117
  cutout Top: 115.7,50.8 110.87,50.8 110.87,54.1 115.7,54.1
N$118
  cutout Top: 11.53,54.99 7.47,54.99 7.47,57.76 11.53,57.76
N$119
  cutout Top: 13.06,57.53 10.77,57.53 10.77,59.28 13.06,59.28
N$120
  cutout Top: 45.31,60.83 45.06,60.83 45.06,61.82 45.31,61.82
N$121
  cutout Top: 44.55,62.36 44.3,62.36 44.3,64.62 44.55,64.62
N$122
  cutout Top: 67.18,36.32 67.18,35.56 65.48,35.56 65.48,36.32
N$123
  cutout Top: 45.67,51.77 44.35,51.77 44.35,52.6 45.67,52.6
N$124
  cutout Bottom: 66.8,29.21 66.8,27.94 67.56,27.94 67.56,29.21
N$125
  cutout Top: 40.79,19.91 38.51,19.91 38.51,21.79 40.79,21.79
N$126
  cutout Top: 103.38,41.02 101.45,41.02 101.45,42.77 103.38,42.77
N$127
  cutout Top: 92.25,59.95 92.25,60.96 93.98,60.96 93.98,59.95
N$128
  cutout Top: 60.35,28.93 59.59,28.93 59.59,30.18 60.35,30.18
N$129
  cutout Top: 44.58,48.08 44.58,47.32 43.33,47.32 43.33,48.08
N$130
  cutout Top: 119.23,76.22 119.23,77.24 120.7,77.24 120.7,76.22
N$131
  cutout Top: 119.33,72.35 119.33,73.12 120.45,73.12 120.45,72.35
N$132
  cutout Top: 61.87,22.2 59.08,22.2 59.08,23.32 61.87,23.32
N$133
  cutout Top: 19.2,45.7 16.5,45.71 16.5,45.71 15.24,45.71 15.24,43.69 15.21,42.65 5.74,42.65 5.74,49.73 19.2,49.73
N$134
  cutout Top: 39.01,51.18 39.01,50.6 41.43,50.6 41.43,51.18
N$135
  cutout Top: 112.01,70 112.01,72.24 115.16,72.24 115.16,70
N$136
  cutout Top: 57.68,13.59 arc90 56.16,12.06 arc90 57.62,10.6 arc90 59.14,12.13 arc90
N$137
  cutout Top: 35.92,29.54 38.46,29.54 38.46,25.1 35.92,25.1
N$138
  cutout Bottom: 55.04,57.91 55.8,57.91 55.8,59.21 55.04,59.21
N$139
  cutout Top: 46.74,39.24 46.74,37.34 47.37,37.34 47.37,39.24
N$140
  cutout Top: 45.19,23.32 45.19,22.56 40.64,22.56 40.64,23.32
N$141
  cutout Top: 33.73,37.77 33.73,35.31 36.91,35.31 36.91,37.77
N$142
  cutout Top: 54.18,49.61 54.18,57.15 52.33,57.15 52.32,57.15 50.85,57.15 50.85,55.68 49.34,55.68 49.34,49.55
N$143
  cutout Bottom: 30.63,14.73 30.63,11.68 38.35,11.68 38.35,13.46 41.4,13.46 41.4,16 33.78,16 33.78,14.73
N$144
  cutout Top: 58.88,37.59 59.89,37.59 59.89,38 58.88,38
N$145
  cutout Top: 71.73,55.73 71.73,59.84 69.49,59.84 69.49,55.73
N$146
  cutout Top: 62.38,71.78 62.38,67.97 63.35,67.97 63.35,71.78
N$147
  cutout Top: 86.51,61.11 86.51,60.1 87.73,60.1 87.73,61.11
N$148
  cutout Top: 81.94,59.33 81.94,58.32 85.19,58.32 85.19,59.33
N$149
  cutout Top: 46.56,43.18 45.8,43.18 45.8,45.44 46.56,45.44
N$150
  cutout Bottom: 54.18,49.61 54.18,57.15 52.33,57.15 52.32,57.15 50.85,57.15 50.85,55.68 49.34,55.68 49.34,49.55
N$151
  cutout Top: 30.89,60.55 30.89,58.83 33.88,58.83 33.88,60.55
N$152
  cutout Top: 22.25,59.72 22.25,58.8 20.6,58.8 20.6,59.72
N$153
  cutout Top: 36.98,58.32 36.98,56.03 38.46,56.03 38.46,58.32
N$154
  cutout Bottom: 39.27,58.57 37.74,58.57 37.74,62.33 39.27,62.33
N$155
  cutout Top: 39.83,37.82 39.83,35.41 45.03,35.41 45.03,37.82
N$156
  cutout Top: 57.15,28.45 57.15,26.57 60.2,26.57 60.2,28.45
N$157
  cutout Top: 40.23,42.95 40.23,43.71 38.99,43.71 38.99,42.95
N$158
  cutout Top: 33.73,18.85 33.73,15.8 37.95,15.8 37.95,18.85
N$159
  cutout Top: 59.49,31.8 59.49,30.78 59.79,30.78 59.79,31.8
N$160
  cutout Top: 66.04,47.24 66.04,46.23 67.26,46.23 67.26,47.24
N$161
  cutout Bottom: 36.09,46.69 36.09,45.92 37.34,45.92 37.34,46.69
N$162
  cutout Top: 95.15,50.9 95.15,52.43 94.69,52.43 94.69,50.9
N$163
  cutout Top: 91.39,51.46 91.39,49.94 92.35,49.94 92.35,51.46
N$164
  cutout Top: 60.45,48.08 60.45,45.01 61.67,45.01 61.67,48.08
N$165
  cutout Top: 67.97,46.02 67.97,44.81 68.43,44.81 68.43,46.02
N$166
  cutout Top: 59.74,35.66 59.74,34.65 60.2,34.65 60.2,35.66
N$167
  cutout Top: 52.22,36.63 52.22,35.36 52.93,35.36 52.93,36.63
N$168
  cutout Top: 60.71,40.64 63.25,40.64 64.26,41.66 63.75,42.16 60.71,42.16
N$169
  cutout Bottom: 59.94,29.72 59.94,28.7 60.71,28.7 60.71,29.72
N$170
  cutout Bottom: 59.64,34.49 60.66,34.49 60.66,35.26 59.64,35.26
N$171
  cutout Top: 52.98,49.68 52.98,48.67 54.2,48.67 54.2,49.68
N$172
  cutout Bottom: 39.78,55.78 37.74,55.78 37.74,58.27 39.78,58.27
N$173
  cutout Top: 13.03,55.47 15.16,55.47 15.16,52.25 13.03,52.25
N$174
  cutout Top: 39.04,46.05 39.04,43.56 41.43,43.56 41.43,46.05
N$175
  cutout Top: 58.98,54.86 58.98,53.85 60.2,53.85 60.2,54.86
N$176
  cutout Top: 64.31,27.84 65.23,27.84 65.23,29.77 64.31,29.77
N$177
  cutout Top: 50.8,18.85 50.8,17.22 54.81,17.22 54.81,18.85
N$178
  cutout Bottom: 67.61,52.4 67.61,50.83 62.56,50.83 62.56,52.4
N$179
  cutout Top: 69.34,60.53 68.58,60.53 68.58,61.72 69.34,61.72
N$180
  cutout Top: 22.25,57.78 22.25,55.55 20.65,55.55 20.65,57.78
N$181
  cutout Top: 98.04,60.76 99.01,60.76 99.01,64.87 98.04,64.87
N$182
  cutout Top: 28.78,49.02 28.02,49.02 28.02,50.27 28.78,50.27
N$183
  cutout Top: 53.01,27.38 52.25,27.38 52.25,28.63 53.01,28.63
N$184
  cutout Top: 49.63,27.61 49.63,26.85 48.39,26.85 48.39,27.61
N$185
  cutout Top: 54.94,21.34 54.18,21.34 54.18,22.58 54.94,22.58
N$186
  cutout Top: 36.3,18.59 35.38,18.59 35.38,21.97 36.3,21.97
N$187
  cutout Bottom: 41.76,36.3 41.76,35.53 40.51,35.53 40.51,36.3
N$188
  cutout Bottom: 64.06,41.94 64.06,41.17 62.81,41.17 62.81,41.94
N$189
  cutout Top: 106.22,19.81 109.22,19.81 109.22,23.62 106.89,23.62 106.89,20.83 106.22,20.83
N$190
  cutout Top: 110.29,19.81 113.28,19.81 113.28,23.62 110.96,23.62 110.96,20.83 110.29,20.83
N$191
  cutout Top: 114.35,19.76 117.35,19.76 117.35,23.57 115.02,23.57 115.02,20.78 114.35,20.78
N$192
  cutout Top: 118.41,19.81 121.41,19.81 121.41,23.62 119.08,23.62 119.08,20.83 118.41,20.83
N$193
  cutout Bottom: 30.33,51.03 30.33,48.49 27.81,48.49 27.81,51.03
N$194
  cutout Bottom: 66.6,47.78 66.6,47.02 63.83,47.02 63.83,47.78
N$195
  cutout Bottom: 99.01,60.76 98.04,60.76 98.04,64.87 99.01,64.87
N$196
  cutout Top: 75.64,52.35 74.88,52.35 74.88,54.1 75.64,54.1
N$197
  cutout Top: 35.03,41.5 35.79,41.5 35.79,42.75 35.03,42.75
N$198
  cutout Top: 63.14,68.99 63.14,67.97 64.11,67.97 64.11,68.99
N$199
  cutout Bottom: 34.77,41.71 34.77,42.47 33.53,42.47 33.53,41.71
N$200
  cutout Top: 35.03,30.68 35.03,29.92 33.78,29.92 33.78,30.68
N$201
  cutout Top: 40.79,28.88 40.03,28.88 40.03,30.12 40.79,30.12
N$202
  cutout Bottom: 44.75,36.14 44.75,35.38 43.51,35.38 43.51,36.14
N$203
  cutout Bottom: 42.57,23.29 42.57,22.53 40.77,22.53 40.77,23.29
N$204
  cutout Bottom: 51.92,44.53 51.92,43.76 50.67,43.76 50.67,44.53
N$205
  cutout Top: 105.73,53.9 105.73,55.46 104.46,55.46 104.46,53.9
N$206
  cutout Bottom: 53.92,41.2 54.69,41.2 54.69,33.81 53.92,33.81
N$207
  cutout Top: 65.05,57.66 64.29,57.66 64.29,58.9 65.05,58.9
N$208
  cutout Top: 44.25,15.27 45.01,15.27 45.01,13.72 44.25,13.72
N$209
  cutout Bottom: 57.68,13.59 arc90 56.16,12.06 arc90 57.62,10.6 arc90 59.14,12.13 arc90
N$210
  cutout Top: 74.19,13.84 arc90 72.67,12.32 arc90 74.13,10.86 arc90 75.65,12.38 arc90
N$211
  cutout Bottom: 74.19,13.84 arc90 72.67,12.32 arc90 74.13,10.86 arc90 75.65,12.38 arc90
N$212
  cutout Top: 90.96,13.84 arc90 89.43,12.32 arc90 90.89,10.86 arc90 92.42,12.38 arc90
N$213
  cutout Bottom: 90.96,13.84 arc90 89.43,12.32 arc90 90.89,10.86 arc90 92.42,12.38 arc90
N$214
  cutout Bottom: 86.51,33.07 87.53,33.07 87.53,33.83 86.51,33.83
N$215
  cutout Bottom: 87.99,19.46 89.31,19.46 89.31,20.22 87.99,20.22
N$216
  cutout Bottom: 35.79,22.66 35.79,23.42 34.29,23.42 34.29,22.66
N$217
  cutout Bottom: 38.51,19.48 37.74,19.48 37.74,15.7 38.51,15.7
N$218
  cutout Top: 16.69,34.14 15.27,34.14 15.27,35.28 16.69,35.28
N$219
  cutout Top: 66.09,26.06 67.11,26.06 67.11,27.28 66.09,27.28
N$220
  cutout Bottom: 7.59,13.51 7.59,14.27 5.08,14.27 5.08,13.51
N$221
  cutout Top: 95.4,57.83 95.4,56.27 92.01,56.27 92.01,57.83
N$222
  cutout Bottom: 44.09,21.26 43.33,21.26 43.33,20.02 44.09,20.02
N$223
  cutout Top: 66.62,30.48 66.62,31.45 68.63,31.45 68.63,30.48
N$224
  cutout Top: 83.19,14.55 86.13,14.55 86.13,11.23 83.19,11.23
N$225
  cutout Top: 67.51,27.97 66.55,27.97 66.55,30.48 67.51,30.48
OSC2
  Top 0.254: IC6.37 65.55,47.96 OSC1.P$3
OUT0_BNC_5V  (via drill 0.35)
  Top 0.203: v44.14,43.94 40.58,43.94 40.6,43.92 U5.8 | v43.73,14.47 44.49,13.72 R18.2
  Bottom 0.203: v44.14,43.94 43.22,43.03 43.22,14.98 v43.73,14.47
OUT1_BNC_5V  (via drill 0.35)
  Top 0.203: v42.65,14.68 43.2,15.24 67.56,15.24 68.11,14.7 R19.2 | v43.31,47.75 43.29,47.73 U5.11
  Bottom 0.203: v43.31,47.75 42.62,47.07 42.62,14.71 v42.65,14.68
OUT_0_BNC
  Top 0.254: X3.1 56.1,13.72 R18.1
OUT_1_BNC
  Top 0.254: X4.1 72.91,13.66 69.86,13.66 R19.1
OUT_CAM0_TRIGGER_3V3  (via drill 0.35)
  Top 0.203: v65.53,19.05 54.61,19.05 53.75,19.91 47.12,19.91 46.63,19.43 v45.11,19.43 | v65.53,21.34 66.29,21.34 66.61,21.66 IC2.4 | U5.2 28.47,50.27 v28.45,50.29 | U2.3 44.45,23.37 44.09,23.01 v44.09,22.86 | v44.74,35.67 44.25,35.18 v28.45,35.18
  Bottom 0.152: v65.53,21.34 v65.53,19.05
  Bottom 0.203: v28.45,50.29 v28.45,35.18 28.45,22.86 26.52,20.93 14.13,20.93 13.37,20.17 X1.4 | v44.74,35.67 44.09,35.03 v44.09,22.86 44.09,20.45 v45.11,19.43
OUT_CAM0_TRIGGER_5V  (via drill 0.35)
  Top 0.203: U5.3 27.55,49 v27.53,49.02
  Bottom 0.203: v27.53,49.02 27.53,24.13 25.86,22.46 13.24,22.46 12.1,21.31 X1.3
OUT_CAM1_TRIGGER_3V3  (via drill 0.35)
  Top 0.203: IC3.4 50.57,22.84 v50.55,22.86 | v48.26,27.18 U2.6 | U5.5 35.8,46.46 v35.81,46.48 | X2.4 35.37,17.7 35.7,18.03 41.1,18.03 41.74,17.39 50.22,17.45 v50.55,17.78
  Bottom 0.203: v48.26,27.18 50.16,27.18 50.55,26.8 v50.55,22.86 v50.55,17.78 | v35.81,46.48 36.02,46.27 36.02,15.75 X2.4
OUT_CAM1_TRIGGER_5V  (via drill 0.35)
  Top 0.254: U5.6 31.77,45.19 v31.75,45.21
  Bottom 0.254: X2.3 34.09,24.74 34.5,25.15 34.5,44.75 34.04,45.21 v31.75,45.21
PDI_CLK  (via drill 0.35)
  Top 0.254: v66.14,42.24 67.15,43.25 IC6.35 | v64.77,54.99 64.76,55.01 C37.1 59.56,55.02 R34.1 54.07,55.02 SV1.5
  Bottom 0.254: v66.14,42.24 66.78,42.88 66.78,48.41 65.79,49.4 65.79,53.98 v64.77,54.99
PDI_DATA  (via drill 0.35)
  Top 0.254: IC6.34 67.95,42.65 v66.9,41.6 | SV1.1 57.41,51.05 58.42,52.06 67.06,52.06 v67.44,51.69
  Bottom 0.254: v67.44,51.69 67.54,51.59 67.54,42.24 v66.9,41.6
U_CAM0_TRIGGER_INV_ENBL  (via drill 0.35)
  Top 0.203: R6.2 71.37,25.4 71.35,25.42 IC2.1 68.51,26.69 67.06,28.15 v67.06,29.21 | IC6.43 60.75,41.75 v60.45,41.45
  Bottom 0.203: v67.06,29.21 66.7,29.57 61.37,29.57 60.71,30.23 60.71,41.2 v60.45,41.45
U_CAM0_TRIGGER_N-INV-ENBL  (via drill 0.35)
  Top 0.203: U2.1 51.66,20.83 v51.71,20.78 51.77,20.83 53.58,20.83 R4.2 | IC6.44 51.95,44.08 v51.92,44.04
  Bottom 0.203: v51.71,20.78 51.69,20.81 51.69,43.81 v51.92,44.04
U_CAM0_TRIGGER_TO_OUT0_BNC_ENBL
  Top 0.203: IC6.4 55.96,39.93 55.76,40.13 46.67,40.13 45.65,41.15 39.88,41.15 39.12,40.39 U4.10
U_CAM1_TRIGGER_INV_ENBL
  Top 0.254: IC6.14 61.55,25.57 IC3.1 63.62,25.42 R7.2
U_CAM1_TRIGGER_N-INV_ENBL  (via drill 0.35)
  Top 0.203: v53.06,27.23 53.06,26.53 R2.2 50.29,25.92 50.04,25.67 50.04,24.89 49.78,24.64 U2.4 | IC6.15 62.35,27.82 62.36,27.81 v62.36,27.05
  Bottom 0.203: v62.36,27.05 53.24,27.05 v53.06,27.23
U_CAM1_TRIGGER_TO_OUT1_BNC_ENBL  (via drill 0.35)
  Top 0.203: U4.13 35.31,41.53 35.56,41.79 48.13,41.79 v48.26,41.66 | IC6.5 56.28,39.13 55.89,38.74 50.17,38.74 49.53,38.1 48.32,38.1 v48.26,38.16
  Bottom 0.203: v48.26,41.66 v48.26,38.16
U_IN0_BNC_5V  (via drill 0.35)
  Top 0.203: IC6.7 42.99,37.53 v41.88,36.42 | U2.11 v41.88,24.64
  Bottom 0.203: v41.88,36.42 v41.88,24.64
U_IN0_TO_CAM0_TRIGGER_ENBL  (via drill 0.35)
  Top 0.203: IC6.1 50.33,42.33 49.81,42.85 34.41,42.85 v33.58,42.01 | v33.66,30.33 34.04,30.7 U4.1
  Bottom 0.203: v33.58,42.01 33.66,41.94 v33.66,30.33
U_IN0_TO_CAM1_TRIGGER_ENBL  (via drill 0.35)
  Top 0.203: v46.99,40.99 53.59,40.99 54.13,41.53 IC6.2 | v46.99,34.29 38.1,34.29 37.85,34.04 U4.4
  Bottom 0.203: v46.99,40.99 v46.99,34.29
U_IN_CAM1_STROBE_5V  (via drill 0.35)
  Top 0.203: U3.3 37.59,62.23 38.61,61.21 v38.61,59.44 | v64.01,41.66 63.15,42.51 IC6.40
  Bottom 0.203: v38.61,59.44 39.01,59.03 63.14,59.03 63.5,58.67 63.5,42.16 v64.01,41.66
U_IN_CAM1_STROBE_PULLUP_5V  (via drill 0.35)
  Top 0.203: U3.6 v38.17,58.42 | v62.84,41 62.33,41.5 62.33,44.06 IC6.41
  Bottom 0.203: v38.17,58.42 61.46,58.42 62.84,57.05 v62.84,41
U_IN_CAM2_STROBE_5V  (via drill 0.35)
  Top 0.203: U3.8 41.76,57.16 42.01,56.9 v44.7,56.9 | IC6.13 60.75,30.78 60.45,30.48 50.29,30.48 49.53,31.24 v49.53,34.04
  Bottom 0.203: v44.7,56.9 45.47,56.13 45.47,49.68 49.53,45.62 v49.53,34.04
U_IN_CAM2_STROBE_PULLUP_5V  (via drill 0.35)
  Top 0.203: IC6.12 59.36,33.17 v50.8,33.17 | v46.48,57.15 46.48,60.56 46.08,60.97 U3.11
  Bottom 0.203: v46.48,57.15 46.48,50.29 50.75,46.02 50.75,33.22 v50.8,33.17
U_IO_CAM0_TRIGGER  (via drill 0.35)
  Top 0.203: 66.35,27.63 IC6.20 | 66.35,27.63 67.56,26.42 IC2.2 v67.56,24.13 | v53.34,22.1 48.13,22.1 | U2.2 48.13,22.1 | U4.3 36.58,30.99 37.08,30.48 v38.1,30.48 | U4.9 40.39,37.34 39.88,36.83 v38.35,36.83 | 48.13,22.1 v48.13,21.47 | v48.13,18.72 48.11,18.7 43.41,18.7 42.42,19.68 v38.1,19.68 | R3.2 66.16,27.43 66.35,27.63
  Bottom 0.203: v67.56,24.13 66.55,23.11 54.36,23.11 v53.34,22.1 | v38.35,36.83 38.1,36.58 v38.1,30.48 v38.1,19.68 | v48.13,21.47 v48.13,18.72
U_IO_CAM1_TRIGGER  (via drill 0.35)
  Top 0.203: IC3.2 60.45,26.67 | 60.45,26.67 v60.45,29.46 60.45,28.93 60.22,28.7 50.04,28.7 49.53,28.19 49.53,26.26 49.17,25.91 U2.5 42.67,25.91 41.91,26.67 v41.25,26.67 | IC6.10 59.41,35.13 v59.74,34.8 | U4.12 36.58,36.7 37.08,36.2 39.74,36.2 40.13,35.81 v40.64,35.81 | U4.6 40.39,30.99 v40.89,30.48 | R5.2 59.94,27.18 60.45,26.67
  Bottom 0.203: v59.74,34.8 59.74,30.18 v60.45,29.46 | v41.25,26.67 41.15,26.67 41.15,30.23 v40.89,30.48 40.89,35.56 v40.64,35.81
U_OUT0_BNC_5V  (via drill 0.35)
  Top 0.203: IC6.21 67.15,38.77 66.29,39.62 v60.05,39.62 | v55.63,39.37 55.59,39.33 46.69,39.35 46.23,38.89 v44.83,38.89 U4.8 | U5.9 40.25,45.21 41.9,45.21 42.28,44.83 R10.1 45.59,44.82 v45.59,43.69
  Bottom 0.203: v60.05,39.62 59.94,39.62 59.69,39.37 v55.63,39.37 | v45.59,43.69 45.59,39.62 44.83,38.86 v44.83,38.89
U_OUT1_BNC_5V  (via drill 0.35)
  Top 0.203: v38.1,49.02 38.12,49 U5.12
  Top 0.254: IC6.11 53.89,34.33 v53.85,34.29 | U5.12 44.92,49 R11.1 44.7,48.78 44.7,46.99 45.23,46.46 53.1,46.46 v53.85,45.72 | v38.1,40.64 37.85,40.39 U4.11
  Bottom 0.203: v38.1,40.64 v38.1,49.02
  Bottom 0.254: v53.85,45.72 v53.85,34.29
USBDM
  Top 0.254: IC1.P$6 114.34,62.76 C13.1 114.44,60.07 arc-45 114.17,59.44 arc-45 113.48,59.15 IC4.16
USBDP
  Top 0.254: IC1.P$4 112.44,62.84 C10.1 112.26,60.66 arc-45 112.01,60.07 arc-45 111.36,59.8 IC4.15
VDD  (via drill 0.35)
  Top 0.254: C26.1 53.47,35.93 IC6.9 62.22,35.93 v62.23,35.92 v65.53,35.92 65.55,35.9 IC6.19 65.55,29.37 65.29,29.11 C29.1 | OSC1.P$4 65.84,49.99 67.69,49.99 C25.1 v74.41,49.94 v74.42,49.94 | IC6.39 63.95,45.52 63.5,45.97 61.72,45.97 61.06,46.63 C28.1 59.79,48.42 v59.76,48.46 53.01,48.46 SV1.2 50.42,51.44 51.31,52.32 54.44,52.32 55.63,53.52 56.95,53.52 R34.2 | v74.42,39.88 75.08,40.54 C27.1 75.51,40.73 IC6.31 | C30.1 77,34.04 v74.42,34.04
  Top 0.305: F1.1 81.45,33.67 77.37,33.67 C30.1
  Bottom 0.254: v74.42,49.94 v74.42,39.88 v74.42,34.04 66.42,34.04 65.53,34.92 v65.53,35.92 | v59.76,48.46 61.72,46.49 61.72,39.98 62.23,39.47 v62.23,35.92
VREF
  Top 0.305: U1.12 23.81,57.31 arc45 R13.2 R12.1

## Text on the board
tPlace: harp camera controller v1.1 | o | o | o | o | + | o | o